# EAGLE design xbeeshield-v12 (EAGLE 5.10)
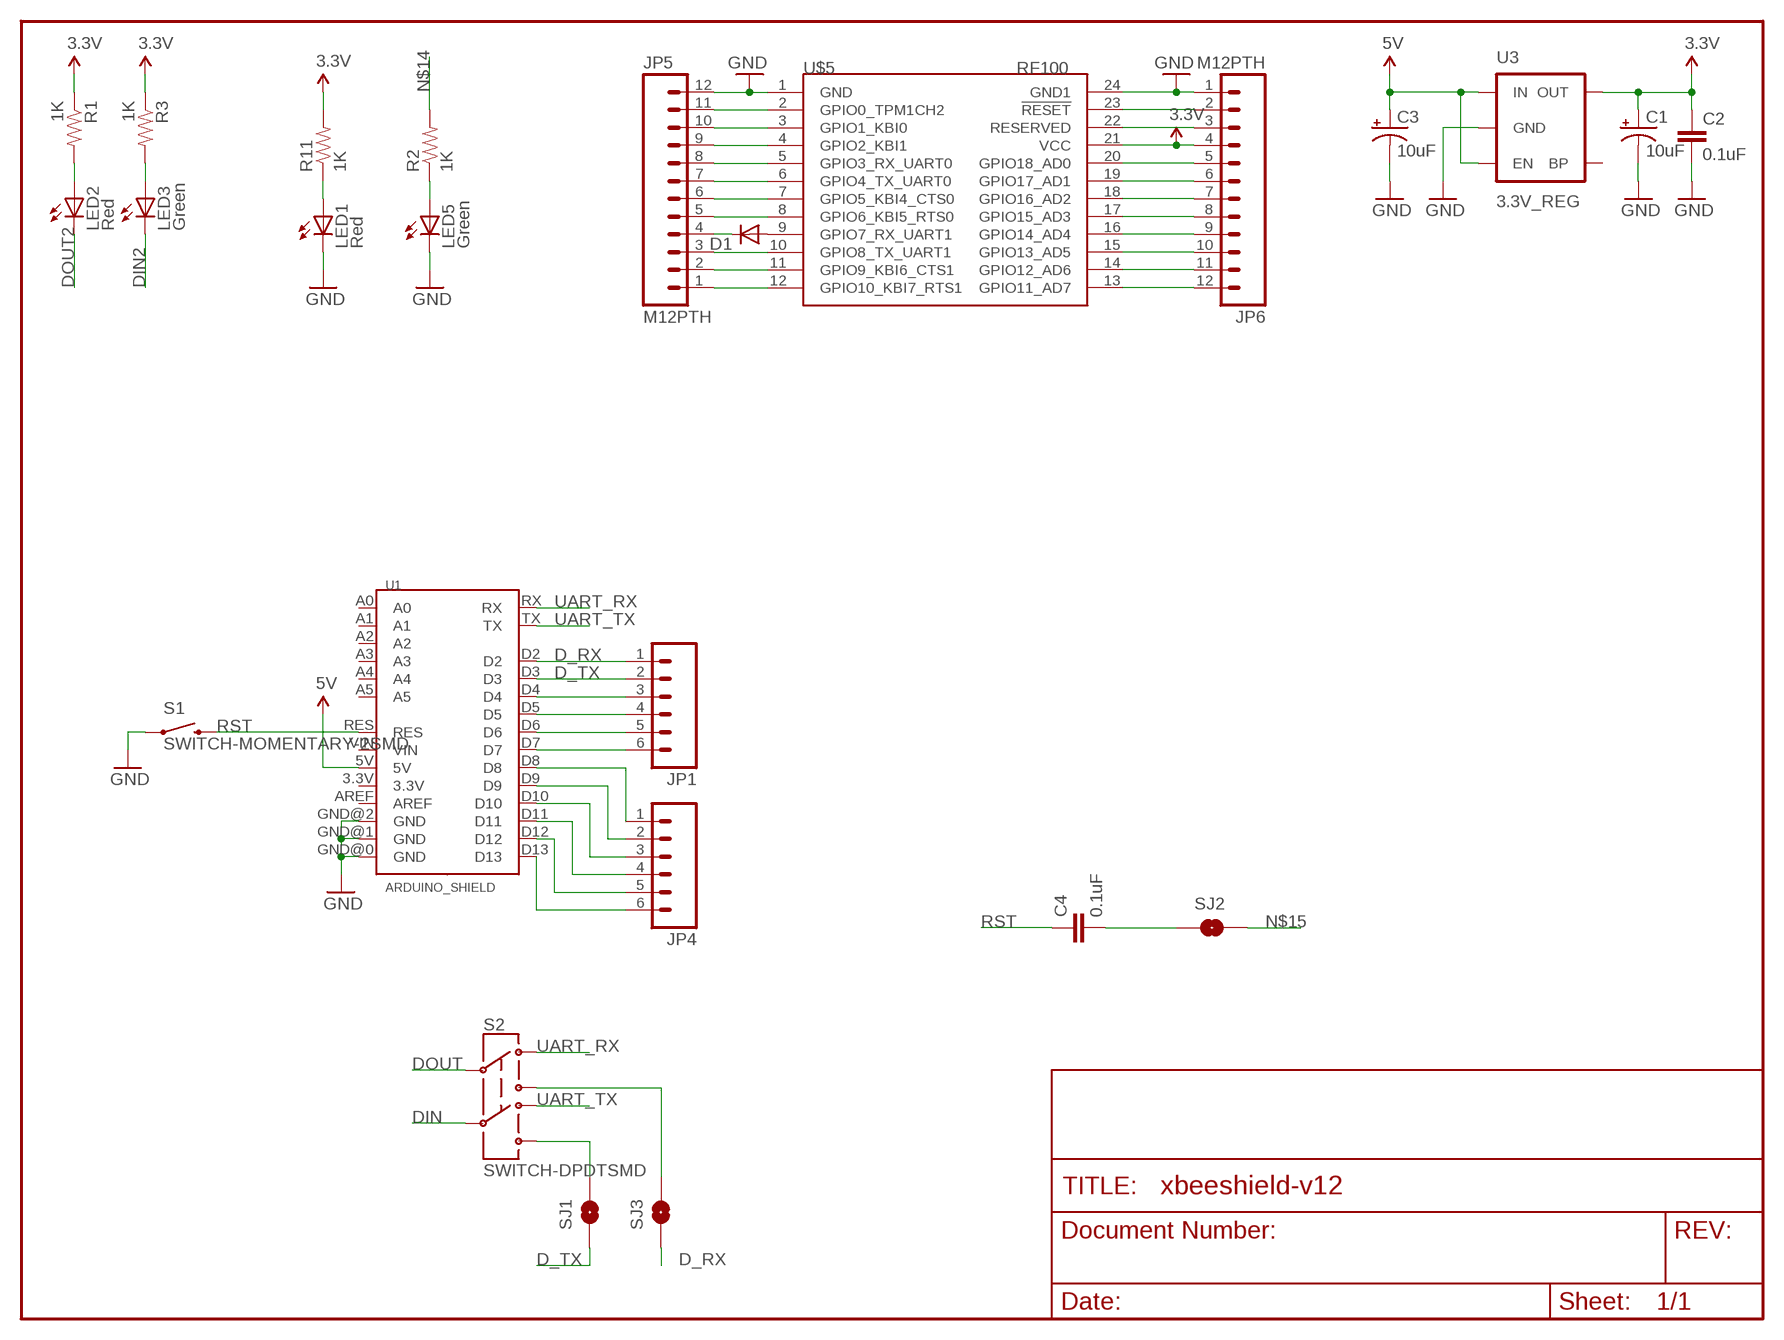
[diagram p0: schematic, sheet 1]

## Parts
C1  10uF  CAP_POL1206  [EIA3216]
C2  0.1uF  CAP0402-CAP  [0402-CAP]
C3  10uF  CAP_POL1206  [EIA3216]
C4  0.1uF  CAP0402-CAP  [0402-CAP]
D1  DIODESOD  [SOD-323]
JP1  M06SIP  [1X06]
JP4  M06SIP  [1X06]
JP5  M12PTH  [1X12]
JP6  M12PTH  [1X12]
LED1  Red  LED0603  [LED-0603]
LED2  Red  LED0603  [LED-0603]
LED3  Green  LED0603  [LED-0603]
LED5  Green  LED0603  [LED-0603]
R1  1K  RESISTOR0402-RES  [0402-RES]
R2  1K  RESISTOR0402-RES  [0402-RES]
R3  1K  RESISTOR0402-RES  [0402-RES]
R11  1K  RESISTOR0402-RES  [0402-RES]
S1  SWITCH-MOMENTARY-2SMD  [TACTILE_SWITCH_SMD]
S2  SWITCH-DPDTSMD  [AYZ0202]
SJ1  D_TX  SOLDERJUMPERNC  [SJ_2S]
SJ2  SOLDERJUMPERTRACE  [SJ_2S-TRACE]
SJ3  D_RX  SOLDERJUMPERNC  [SJ_2S]
U1  ARDUINO_SHIELD  [DUEMILANOVE_SHIELD]
U3  3.3V_REG  V_REG_LDOSMD  [SOT23-5]
U$5  SYNAPSEWIRELESS-RFENGINETHM-SILK-TPLACE  [SYNAPSERFENGINE-THM-SILKTPLACE]

## Nets
3.3V: C1.A(+) C2.1 JP6.4 R1.1 R3.1 R11.2 U3.5(OUT) U$5.21(VCC)
5V: C3.A(+) U1.5V U3.1(IN) U3.3(EN)
D_RX: JP1.1 SJ3.1 U1.D2
D_TX: JP1.2 SJ1.1 U1.D3
DIN: D1.1(C) JP5.4 S2.5
DIN2: JP5.8 LED3.C U$5.5(GPIO3_RX_UART0)
DOUT: JP5.3 S2.2 U$5.10(GPIO8_TX_UART1)
DOUT2: JP5.7 LED2.C U$5.6(GPIO4_TX_UART0)
GND: C1.C(-) C2.2 C3.C(-) JP5.12 JP6.1 LED1.C LED5.C S1.1 U1.GND@0(GND) U1.GND@1(GND) U1.GND@2(GND) U3.2(GND) U$5.1(GND) U$5.24(GND1)
N$1: LED2.A R1.2
N$3: D1.2(A) U$5.9(GPIO7_RX_UART1)
N$4: LED3.A R3.2
N$5: C4.2 SJ2.1
N$6: JP5.1 U$5.12(GPIO10_KBI7_RTS1)
N$7: JP5.2 U$5.11(GPIO9_KBI6_CTS1)
N$10: JP5.5 U$5.8(GPIO6_KBI5_RTS0)
N$11: JP5.6 U$5.7(GPIO5_KBI4_CTS0)
N$14: JP5.9 R2.2 U$5.4(GPIO2_KBI1)
N$15: JP5.10 SJ2.2 U$5.3(GPIO1_KBI0)
N$16: JP5.11 U$5.2(GPIO0_TPM1CH2)
N$17: JP4.1 U1.D8
N$18: JP4.2 U1.D9
N$30: JP4.3 U1.D10
N$38: LED1.A R11.1
N$43: JP4.4 U1.D11
N$55: JP4.5 U1.D12
N$67: JP4.6 U1.D13
N$103: JP6.2 U$5.23(!RESET)
N$115: JP6.3 U$5.22(RESERVED)
N$139: LED5.A R2.1
N$140: S2.6 SJ1.2
N$141: S2.3 SJ3.2
N$142: JP1.3 U1.D4
N$143: JP1.4 U1.D5
N$144: JP1.5 U1.D6
N$145: JP1.6 U1.D7
N$146: JP6.5 U$5.20(GPIO18_AD0)
N$147: JP6.6 U$5.19(GPIO17_AD1)
N$148: JP6.7 U$5.18(GPIO16_AD2)
N$149: JP6.8 U$5.17(GPIO15_AD3)
N$150: JP6.9 U$5.16(GPIO14_AD4)
N$151: JP6.10 U$5.15(GPIO13_AD5)
N$152: JP6.11 U$5.14(GPIO12_AD6)
N$153: JP6.12 U$5.13(GPIO11_AD7)
RST: C4.1 S1.3 U1.RES
UART_RX: S2.1 U1.RX
UART_TX: S2.4 U1.TX
Unconnected: U1.3.3V U1.A0 U1.A1 U1.A2 U1.A3 U1.A4 U1.A5 U1.AREF U1.VIN U3.4(BP)

## Library data of the parts
C1 C3 = SparkFun:CAP_POL: Capacitor Polarized These are standard SMD and PTH capacitors. Normally 10uF, 47uF, and 100uF in electrolytic and tantalum varieties. Always verify the external diameter of the through hole cap, it varies with capacity, voltage, and manufacturer. The EIA devices should be standard.
C2 C4 = SparkFun:CAP: Capacitor Standard 0603 ceramic capacitor, and 0.1" leaded capacitor.
D1 = SparkFun:DIODE: Diode These are standard reverse protection diodes and small signal diodes. SMA package can handle up to about 1A. SOD-323 can handle about 200mA. What the SOD-323 package when ordering, there are some mfgs out there that are 5-pin packages.
JP1 JP4 = SparkFun:M06: Header 6 Standard 6-pin 0.1" header. Use with straight break away headers (SKU : PRT-00116), right angle break away headers (PRT-00553), swiss pins (PRT-00743), machine pins (PRT-00117), and female headers (PRT-00115). Molex polarized connector foot print use with SKU : PRT-08094 with associated crimp pins and housings. NOTES ON THE VARIANTS LOCK and LOCK_LONGPADS... This footprint was designed to help hold the alignment of a through-hole component (i.e. 6-pin header) while soldering it into place. You may notice that each hole has been shifted either up or down by 0.005 of an inch from it's more standard position (which is a perfectly straight line). This slight alteration caused the pins (the squares in the middle) to touch the edges of the holes. Because they are alternating, it causes a "brace" to hold the component in place. 0.005 has proven to be the perfect amount of "off-center" position when using our standard breakaway headers. Although looks a little odd when you look at the bare footprint, once you have a header in there, the alteration is very hard to notice. Also, if you push a header all the way into place, it is covered up entirely on the bottom side. This idea of altering the position of holes to aid alignment will be further integrated into the Sparkfun Library for other footprints. It can help hold any component with 3 or more connection pins.
JP5 JP6 = SparkFun:M12: Header 12 Standard 12-pin 0.1" header. Use with straight break away headers (SKU : PRT-00116), right angle break away headers (PRT-00553), swiss pins (PRT-00743), machine pins (PRT-00117), and female headers (PRT-00115).
LED1-LED3 LED5 = SparkFun:LED: LEDs Standard schematic elements and footprints for 5mm, 3mm, 1206, and 0603 sized LEDs. 5mm - Spark Fun Electronics SKU : COM-00529 (and others)
R1-R3 R11 = SparkFun:RESISTOR: Resistor Basic schematic elements and footprints for 0603, 1206, and PTH 1/10th watt (small) resistors.
S1 = SparkFun:SWITCH-MOMENTARY-2
S2 = SparkFun:SWITCH-DPDT: DPDT Version of the COM-00597
SJ1-SJ3 = SparkFun:SOLDERJUMPER: Solder Jumper Standard SMD solder jumper. Used to automate production. Two varients : Normally Open and Normally Closed are the same, but have different paste layers. NC will have a large amount of paste and should jumper during reflow.
U1 = SparkFun:ARDUINO_SHIELD
U3 = SparkFun:V_REG_LDO: Voltage Regulator LDO Standard 150mA LDO voltage regulator in SOT-23 layout. Micrel part MIC5205. BP (by-pass) pin is used to lower output noise with 470pF cap.
U$5 = 0_jc-custom:SYNAPSEWIRELESS-RFENGINE

## Net classes
0 default: width 0.203 mm
1 vcc: width 0.305 mm

## Board
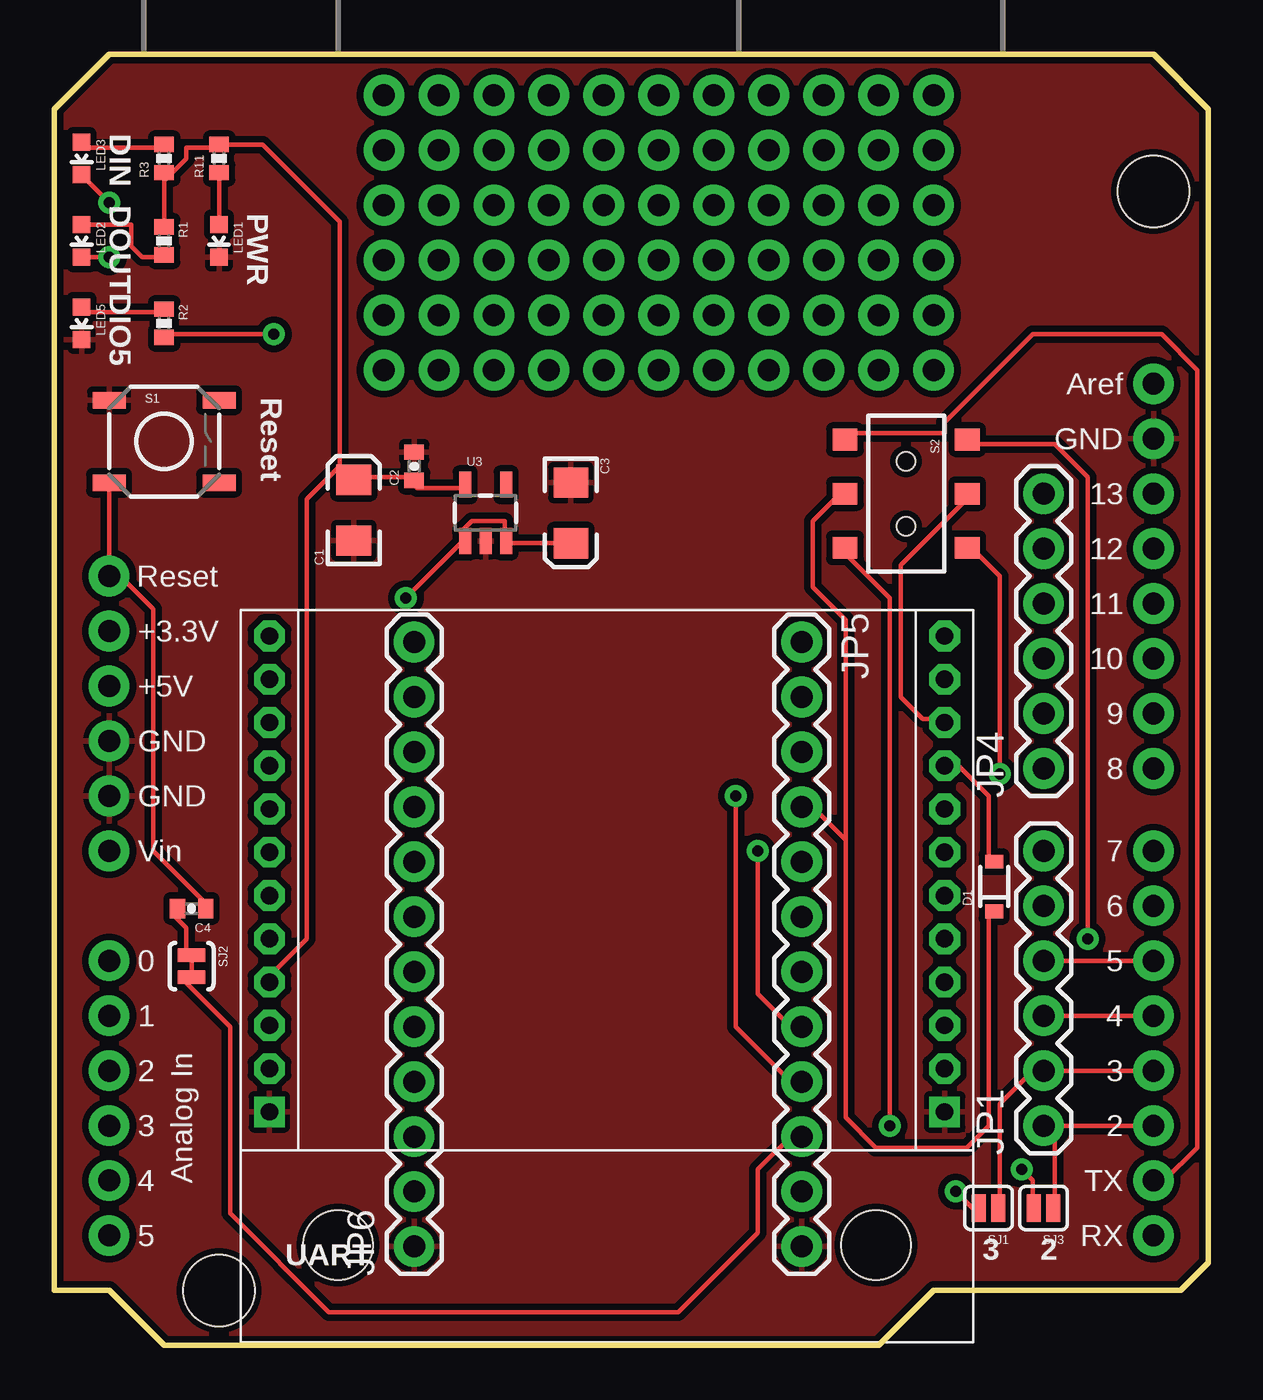
[diagram p1: board, top side]
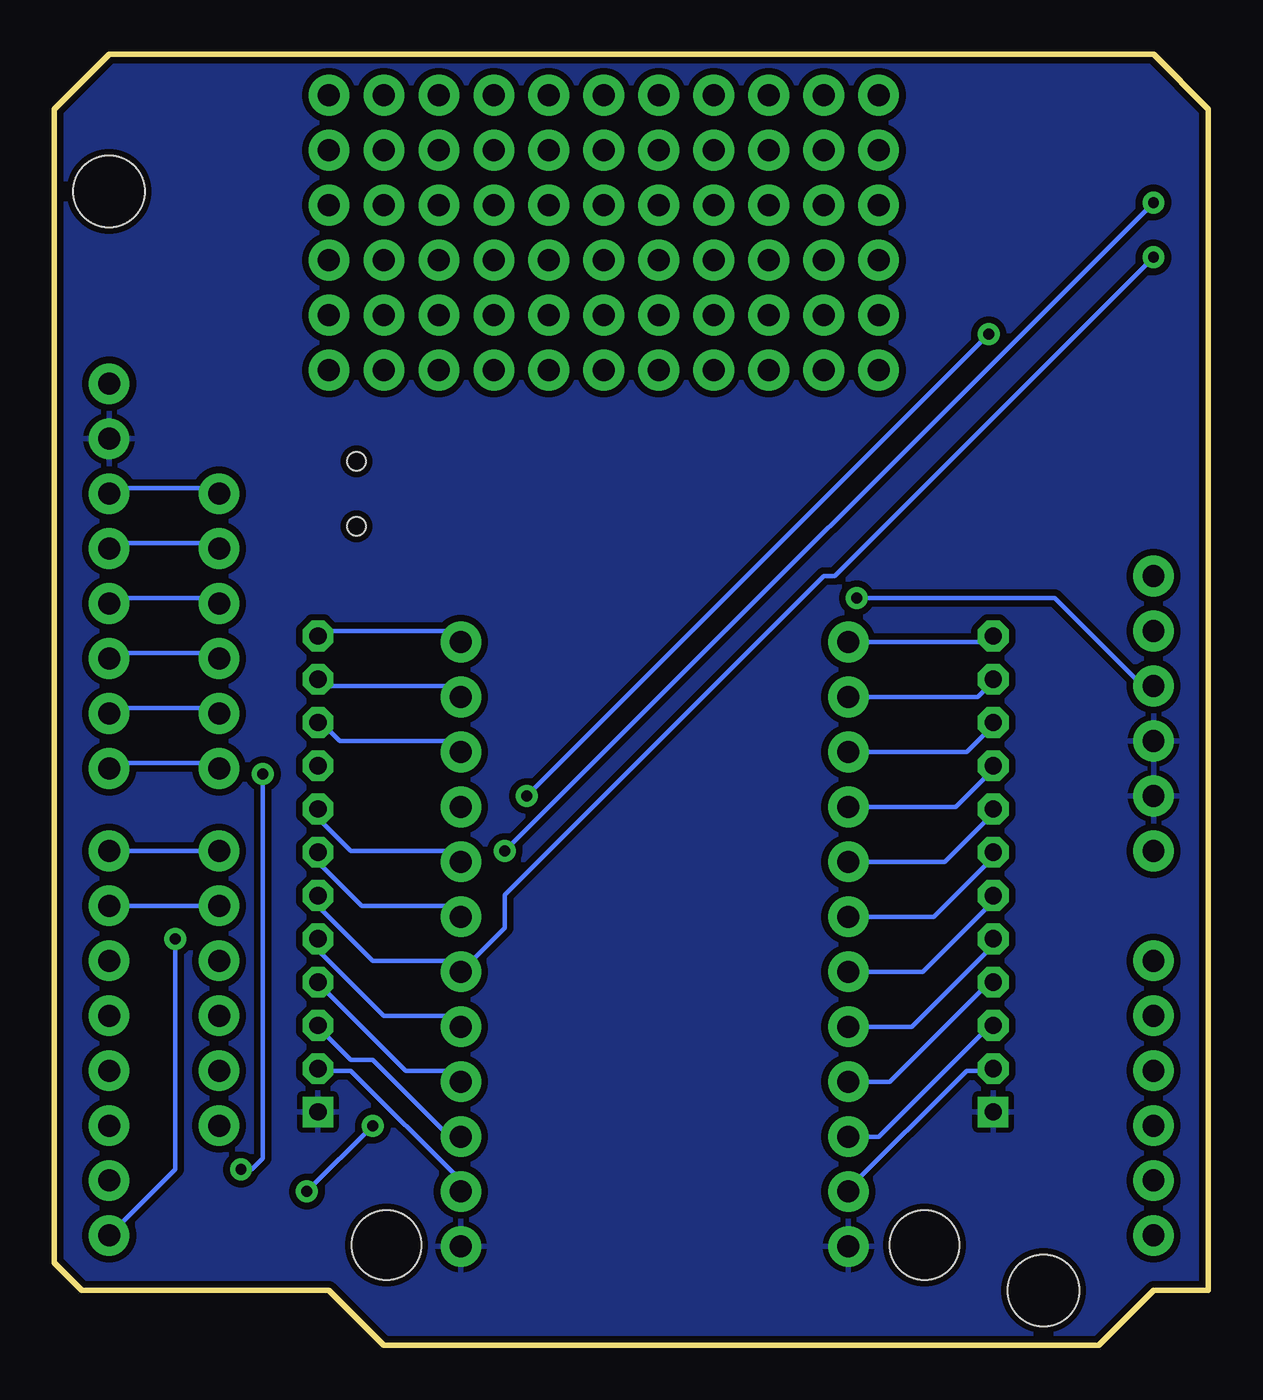
[diagram p2: board, bottom side, seen from below]

Size 53.34 x 59.69 mm. Coordinates in mm from the lower left corner, seen from the top.
Outline: 0,2.54 0,57.15 2.54,59.69 50.8,59.69 53.34,57.15 53.34,3.81 52.07,2.54 40.64,2.54 38.1,0 5.08,0 2.54,2.54 0,2.54
Copper layers (1*16): Top 0.035mm / dielectric 1.5mm / Bottom 0.035mm
Design rules "SparkFun": minimum track width 8mil, minimum drill 20mil, track to track 8mil, track to pad 8mil, pad to pad 8mil, via to via 8mil, smd to smd 8mil, copper to edge 8mil, drill to drill 8mil, minimum pad ring 12mil, minimum via ring 10mil, stop-mask expansion 4mil, vias tented up to drill 20mil, thermal gap 10mil

### Footprints (pad centres in the part's own frame; a part is rotated, then mirrored left to right if it is on the bottom)
EIA3216 = smd 1.4 x 1.6: A 1.4,0; C -1.4,0
0402-CAP = smd 0.7 x 0.9: 1 -0.65,0; 2 0.65,0
SOD-323 = smd 0.63 x 0.83: 1 -1.15,0; 2 1.15,0
1X06 = drill 1.016 pad 1.88 round: 1 0,0; 2 2.54,0; 3 5.08,0; 4 7.62,0; 5 10.16,0; 6 12.7,0
1X12 = drill 1.016 pad 1.88 round: 1 0,0; 2 2.54,0; 3 5.08,0; 4 7.62,0; 5 10.16,0; 6 12.7,0; 7 15.24,0; 8 17.78,0; 9 20.32,0; 10 22.86,0; 11 25.4,0; 12 27.94,0
LED-0603 = smd 0.8 x 0.8: A 0,-0.75; C 0,0.75
0402-RES = smd 0.7 x 0.9: 1 -0.65,0; 2 0.65,0
TACTILE_SWITCH_SMD = smd 1.524 x 0.762: 1 -2.54,1.905; 2 2.54,1.905; 3 -2.54,-1.905; 4 2.54,-1.905
AYZ0202 = smd 1 x 1.15: 1 -2.5,2.825; 2 0,2.825; 3 2.5,2.825; 4 -2.5,-2.825; 5 0,-2.825; 6 2.5,-2.825 | hole 0.85: 1.5,0; -1.5,0
SJ_2S = smd 0.635 x 1.27: 1 -0.45,0; 2 0.45,0
SJ_2S-TRACE = smd 0.635 x 1.27: 1 -0.508,0; 2 0.508,0
DUEMILANOVE_SHIELD = drill 1.016 pad 1.88 round: 3.3V 50.8,26.67; 5V 50.8,29.21; A0 50.8,41.91; A1 50.8,44.45; A2 50.8,46.99; A3 50.8,49.53; A4 50.8,52.07; A5 50.8,54.61; AREF 2.54,15.24; D2 2.54,49.53; D3 2.54,46.99; D4 2.54,44.45; D5 2.54,41.91; D6 2.54,39.37; D7 2.54,36.83; D8 2.54,33.02; D9 2.54,30.48; D10 2.54,27.94; D11 2.54,25.4; D12 2.54,22.86; D13 2.54,20.32; GND@0 50.8,31.75; GND@1 50.8,34.29; GND@2 2.54,17.78; RES 50.8,24.13; RX 2.54,54.61; TX 2.54,52.07; VIN 50.8,36.83 | hole 3.302: 45.72,57.15; 2.54,6.35
SOT23-5 = smd 0.55 x 1.2: 1 -0.95,-1.3; 2 0,-1.3; 3 0.95,-1.3; 4 0.95,1.3; 5 -0.95,1.3
SYNAPSERFENGINE-THM-SILKTPLACE = drill 0.8 square: 1 0,0; 24 31.2,0 | drill 0.8 pad 1.422 octagon: 2 0,-2; 3 0,-4; 4 0,-6; 5 0,-8; 6 0,-10; 7 0,-12; 8 0,-14; 9 0,-16; 10 0,-18; 11 0,-20; 12 0,-22; 13 31.2,-22; 14 31.2,-20; 15 31.2,-18; 16 31.2,-16; 17 31.2,-14; 18 31.2,-12; 19 31.2,-10; 20 31.2,-8; 21 31.2,-6; 22 31.2,-4; 23 31.2,-2 | hole 3.2: 3.17,6.16; 28.03,6.16

### Placement (x,y rotation side)
C1  13.84,38.61 90 top
C2  16.64,40.64 90 top
C3  23.88,38.48 270 top
C4  6.35,20.19 180 top
D1  43.43,21.21 90 top
JP1  45.72,10.16 90 top
JP4  45.72,26.67 90 top
JP5  34.54,32.51 270 top
JP6  16.64,4.57 90 top
LED1  7.62,51.05 180 top
LED2  1.27,51.05 180 top
LED3  1.27,54.86 180 top
LED5  1.27,47.24 180 top
R1  5.08,51.05 270 top
R2  5.08,47.24 270 top
R3  5.08,54.86 90 top
R11  7.62,54.86 90 top
S1  5.08,41.78 0 top
S2  39.37,39.37 270 top
SJ1  43.18,6.35 180 top
SJ2  6.35,17.53 270 top
SJ3  45.72,6.35 180 top
U1  53.34,59.69 180 top
U3  19.94,38.48 0 top
U$5  41.15,10.79 180 top

### Tracks (layer width: path | path; a pad name or v marks a point on that pad's centre or on a via)
3.3V
  Top 0.203: R3.1 5.08,54.36 R3.1 | 5.08,53.85 R3.1 | 5.08,53.85 5.08,51.82 R1.1 | 7.62,55.37 6.1,55.37 6.1,54.86 5.08,53.85 | R11.2 7.62,55.37 | C1.A 14.22,40.13 16.26,40.13 C2.1 16.76,40.13 16.76,39.62 18.8,39.62 U3.5 | 13.21,40.64 13.21,40.13 13.72,39.62 C1.A | R11.2 7.62,55.37 | 13.21,40.64 11.68,39.12 11.68,18.8 10.16,17.27 U$5.21 | 13.21,40.64 C1.A | 13.21,40.64 13.21,51.94 9.65,55.5 7.63,55.5 R11.2
  Bottom 0.203: U$5.21 10.16,16.76 14.73,12.19 16.26,12.19 JP6.4
5V  (via drill 0.51)
  Top 0.203: C3.A 20.83,37.08 U3.3 20.83,37.59 20.83,38.1 19.3,38.1 18.8,37.59 U3.1 18.8,37.08 v16.26,34.54
  Bottom 0.203: v16.26,34.54 7.11,34.54 3.05,30.48 U1.5V
D_RX
  Top 0.203: SJ3.1 46.23,6.6 46.23,9.65 JP1.1 U1.D2
D_TX
  Top 0.203: SJ1.1 43.69,6.6 43.69,11.18 45.21,12.7 JP1.2 U1.D3
DIN
  Top 0.203: 36.58,23.37 35.05,24.89 JP5.4 | D1.1 43.18,19.81 43.18,10.16 42.16,9.14 37.97,9.14 36.58,10.54 36.58,23.37 | 36.58,23.37 36.58,33.53 35.05,35.05 35.05,38.1 36.07,39.12 S2.5
DIN2  (via drill 0.51)
  Top 0.203: v2.54,52.83 1.52,53.85 LED3.C | v32.51,22.86 32.51,16.26 34.04,14.73 JP5.8
  Bottom 0.203: v32.51,22.86 v2.54,52.83 | JP5.8 35.05,15.24 38.1,15.24 41.15,18.29 U$5.5
DOUT
  Top 0.203: S2.2 42.16,39.12 39.12,36.07 39.12,29.97 40.13,28.96 41.15,28.96 U$5.10
  Bottom 0.203: JP5.3 35.05,27.94 40.13,27.94 40.64,28.45 41.15,28.45 U$5.10
DOUT2  (via drill 0.51)
  Top 0.203: v2.54,50.29 1.52,50.29 LED2.C
  Bottom 0.203: v2.54,50.29 17.27,35.56 17.78,35.56 32.51,20.83 32.51,19.3 34.04,17.78 | 34.04,17.78 JP5.7 34.04,17.78 | 34.04,17.78 38.61,17.78 41.15,20.32 U$5.6
GND
  pour Top (isolate 0.305): 0,0 0,59.69 53.34,59.69 53.34,0
  pour Bottom (isolate 0.305): 0,59.69 0,0 53.34,0 53.34,59.69
N$1
  Top 0.203: LED2.A 1.52,51.82 3.56,51.82 3.56,50.8 4.06,50.29 5.08,50.29 R1.2
N$3
  Top 0.203: D1.2 43.18,22.35 43.18,25.4 41.66,26.92 41.15,26.92 U$5.9
N$4
  Top 0.203: LED3.A 1.52,55.37 5.08,55.37 R3.2
N$5
  Top 0.203: C4.2 5.59,19.81 6.1,19.3 6.1,18.29 SJ2.1
N$6
  Bottom 0.203: JP5.1 35.05,33.02 41.15,33.02 U$5.12
N$7
  Bottom 0.203: JP5.2 35.05,30.48 41.15,30.48 U$5.11
N$10
  Bottom 0.203: JP5.5 35.05,22.86 39.62,22.86 41.15,24.38 U$5.8
N$11
  Bottom 0.203: JP5.6 35.05,20.32 39.12,20.32 41.15,22.35 U$5.7
N$14  (via drill 0.51)
  Top 0.203: v10.16,46.74 5.08,46.74 R2.2 | v31.5,25.4 31.5,14.73 34.04,12.19 JP5.9
  Bottom 0.203: v31.5,25.4 v10.16,46.74 | JP5.9 35.05,12.7 37.08,12.7 41.15,16.76 U$5.4
N$15
  Top 0.203: JP5.10 34.04,9.65 32.51,8.13 32.51,5.21 28.83,1.52 12.7,1.52 8.13,6.1 8.13,14.73 6.1,16.76 SJ2.2
  Bottom 0.203: JP5.10 35.05,9.65 38.61,13.21 39.62,13.21 41.15,14.73 U$5.3
N$16
  Bottom 0.203: JP5.11 34.54,7.62 39.62,12.7 41.15,12.7 U$5.2
N$17
  Bottom 0.203: JP4.1 45.72,26.92 50.8,26.92 U1.D8
N$18
  Bottom 0.203: JP4.2 45.72,29.46 50.8,29.46 U1.D9
N$30
  Bottom 0.203: JP4.3 45.72,32 50.8,32 U1.D10
N$38
  Top 0.203: R11.1 7.62,54.36 R11.1 | R11.1 7.62,51.82 LED1.A
N$43
  Bottom 0.203: JP4.4 45.72,34.54 50.8,34.54 U1.D11
N$55
  Bottom 0.203: JP4.5 45.72,37.08 50.8,37.08 U1.D12
N$67
  Bottom 0.203: JP4.6 45.72,39.62 50.8,39.62 U1.D13
N$68  (via drill 1.02 pad 1.88)
  other vias: 40.64,45.09
N$69  (via drill 1.02 pad 1.88)
  other vias: 38.1,45.09
N$70  (via drill 1.02 pad 1.88)
  other vias: 35.56,45.09
N$71  (via drill 1.02 pad 1.88)
  other vias: 33.02,45.09
N$72  (via drill 1.02 pad 1.88)
  other vias: 30.48,45.09
N$73  (via drill 1.02 pad 1.88)
  other vias: 27.94,45.09
N$74  (via drill 1.02 pad 1.88)
  other vias: 25.4,45.09
N$75  (via drill 1.02 pad 1.88)
  other vias: 22.86,45.09
N$76  (via drill 1.02 pad 1.88)
  other vias: 20.32,45.09
N$77  (via drill 1.02 pad 1.88)
  other vias: 17.78,45.09
N$78  (via drill 1.02 pad 1.88)
  other vias: 15.24,45.09
N$80  (via drill 1.02 pad 1.88)
  other vias: 40.64,47.62
N$81  (via drill 1.02 pad 1.88)
  other vias: 38.1,47.62
N$82  (via drill 1.02 pad 1.88)
  other vias: 35.56,47.62
N$83  (via drill 1.02 pad 1.88)
  other vias: 33.02,47.62
N$84  (via drill 1.02 pad 1.88)
  other vias: 30.48,47.62
N$85  (via drill 1.02 pad 1.88)
  other vias: 27.94,47.62
N$86  (via drill 1.02 pad 1.88)
  other vias: 25.4,47.62
N$87  (via drill 1.02 pad 1.88)
  other vias: 22.86,47.62
N$88  (via drill 1.02 pad 1.88)
  other vias: 20.32,47.62
N$89  (via drill 1.02 pad 1.88)
  other vias: 17.78,47.62
N$90  (via drill 1.02 pad 1.88)
  other vias: 15.24,47.62
N$92  (via drill 1.02 pad 1.88)
  other vias: 40.64,50.16
N$93  (via drill 1.02 pad 1.88)
  other vias: 38.1,50.16
N$94  (via drill 1.02 pad 1.88)
  other vias: 35.56,50.16
N$95  (via drill 1.02 pad 1.88)
  other vias: 33.02,50.16
N$96  (via drill 1.02 pad 1.88)
  other vias: 30.48,50.16
N$97  (via drill 1.02 pad 1.88)
  other vias: 27.94,50.16
N$98  (via drill 1.02 pad 1.88)
  other vias: 25.4,50.16
N$99  (via drill 1.02 pad 1.88)
  other vias: 22.86,50.16
N$100  (via drill 1.02 pad 1.88)
  other vias: 20.32,50.16
N$101  (via drill 1.02 pad 1.88)
  other vias: 17.78,50.16
N$102  (via drill 1.02 pad 1.88)
  other vias: 15.24,50.16
N$103
  Bottom 0.203: U$5.23 10.16,12.7 11.18,12.7 16.76,7.11 JP6.2
N$104  (via drill 1.02 pad 1.88)
  other vias: 40.64,52.7
N$105  (via drill 1.02 pad 1.88)
  other vias: 38.1,52.7
N$106  (via drill 1.02 pad 1.88)
  other vias: 35.56,52.7
N$107  (via drill 1.02 pad 1.88)
  other vias: 33.02,52.7
N$108  (via drill 1.02 pad 1.88)
  other vias: 30.48,52.7
N$109  (via drill 1.02 pad 1.88)
  other vias: 27.94,52.7
N$110  (via drill 1.02 pad 1.88)
  other vias: 25.4,52.7
N$111  (via drill 1.02 pad 1.88)
  other vias: 22.86,52.7
N$112  (via drill 1.02 pad 1.88)
  other vias: 20.32,52.7
N$113  (via drill 1.02 pad 1.88)
  other vias: 17.78,52.7
N$114  (via drill 1.02 pad 1.88)
  other vias: 15.24,52.7
N$115
  Bottom 0.203: U$5.22 10.16,14.73 15.24,9.65 16.26,9.65 JP6.3
N$116  (via drill 1.02 pad 1.88)
  other vias: 40.64,55.24
N$117  (via drill 1.02 pad 1.88)
  other vias: 38.1,55.24
N$118  (via drill 1.02 pad 1.88)
  other vias: 35.56,55.24
N$119  (via drill 1.02 pad 1.88)
  other vias: 33.02,55.24
N$120  (via drill 1.02 pad 1.88)
  other vias: 30.48,55.24
N$121  (via drill 1.02 pad 1.88)
  other vias: 27.94,55.24
N$122  (via drill 1.02 pad 1.88)
  other vias: 25.4,55.24
N$123  (via drill 1.02 pad 1.88)
  other vias: 22.86,55.24
N$124  (via drill 1.02 pad 1.88)
  other vias: 20.32,55.24
N$125  (via drill 1.02 pad 1.88)
  other vias: 17.78,55.24
N$126  (via drill 1.02 pad 1.88)
  other vias: 15.24,55.24
N$128  (via drill 1.02 pad 1.88)
  other vias: 40.64,57.78
N$129  (via drill 1.02 pad 1.88)
  other vias: 38.1,57.78
N$130  (via drill 1.02 pad 1.88)
  other vias: 35.56,57.78
N$131  (via drill 1.02 pad 1.88)
  other vias: 33.02,57.78
N$132  (via drill 1.02 pad 1.88)
  other vias: 30.48,57.78
N$133  (via drill 1.02 pad 1.88)
  other vias: 27.94,57.78
N$134  (via drill 1.02 pad 1.88)
  other vias: 25.4,57.78
N$135  (via drill 1.02 pad 1.88)
  other vias: 22.86,57.78
N$136  (via drill 1.02 pad 1.88)
  other vias: 20.32,57.78
N$137  (via drill 1.02 pad 1.88)
  other vias: 17.78,57.78
N$138  (via drill 1.02 pad 1.88)
  other vias: 15.24,57.78
N$139
  Top 0.203: LED5.A 1.52,47.75 5.08,47.75 R2.1
N$140  (via drill 0.51)
  Top 0.203: v38.61,10.16 38.61,34.54 36.58,36.58 S2.6 | v41.66,7.11 42.67,6.1 SJ1.2
  Bottom 0.203: v41.66,7.11 v38.61,10.16
N$141  (via drill 0.51)
  Top 0.203: v43.69,26.42 43.69,35.56 42.67,36.58 S2.3 | v44.7,8.13 45.21,7.62 45.21,6.6 SJ3.2
  Bottom 0.203: v44.7,8.13 44.2,8.13 43.69,8.64 v43.69,26.42
N$142
  Top 0.203: JP1.3 U1.D4
N$143
  Top 0.203: JP1.4 U1.D5
N$144
  Bottom 0.203: JP1.5 U1.D6
N$145
  Bottom 0.203: JP1.6 U1.D7
N$146
  Bottom 0.203: U$5.20 10.16,18.29 13.72,14.73 16.26,14.73 JP6.5
N$147
  Bottom 0.203: U$5.19 10.16,20.32 13.21,17.27 16.26,17.27 JP6.6
N$148
  Bottom 0.203: U$5.18 10.16,22.35 12.7,19.81 16.26,19.81 JP6.7
N$149
  Bottom 0.203: U$5.17 10.16,24.38 12.19,22.35 16.26,22.35 JP6.8
N$150
  Bottom 0.203: U$5.16 10.16,26.42 11.68,24.89 16.26,24.89 JP6.9
N$151
  Bottom 0.203: U$5.15 10.16,28.45 11.18,27.43 16.26,27.43 JP6.10
N$152
  Bottom 0.203: U$5.14 10.16,30.48 10.67,29.97 16.26,29.97 JP6.11
N$153
  Bottom 0.203: U$5.13 10.16,32.51 16.26,32.51 JP6.12
RST
  Top 0.203: C4.1 7.11,20.32 4.57,22.86 4.57,34.04 3.05,35.56 U1.RES 2.54,39.62 S1.3
UART_RX  (via drill 0.51)
  Top 0.203: S2.1 42.67,41.66 46.23,41.66 47.75,40.13 v47.75,18.8
  Bottom 0.203: 50.29,5.59 U1.RX 47.75,8.13 v47.75,18.8
UART_TX
  Top 0.203: 44.96,46.48 41.15,42.67 41.15,42.16 36.58,42.16 S2.4 | 45.21,46.74 44.96,46.48 | U1.TX 51.31,7.62 52.83,9.14 52.83,45.09 51.18,46.74 45.21,46.74 | 45.21,46.74 44.96,46.48

### Text on the board
tPlace: DIN | DOUT | PWR | DIO5 | Reset | 3 | 2 | UART